# Altium schematic sheet USB2514 CRYSTAL.SchDoc
size A4; DocumentNumber: 6; SheetNumber: 6; SheetTotal: 6
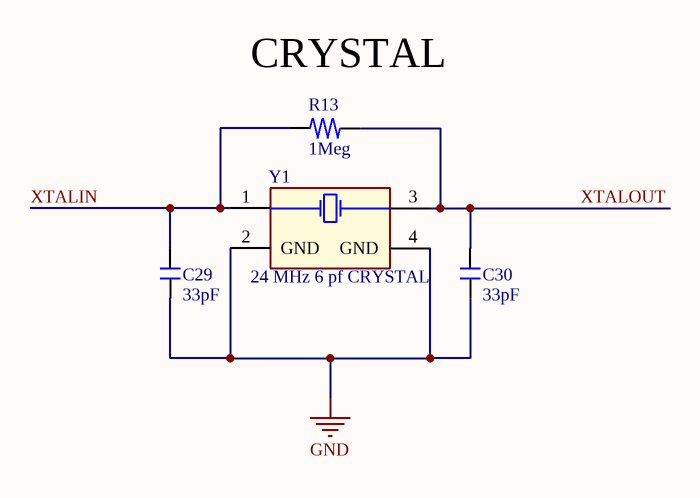
[diagram p0: USB2514 CRYSTAL.SchDoc]

## Parts
C29  33pF  [CAPC1608X06N-0603]
C30  33pF  [CAPC1608X06N-0603]
R13  1Meg  [RESC1608X06N-0603]
Y1  24 MHz 6 pf CRYSTAL  [OSC_XRCGB24M000F2P00R0]

## Nets
GND: C29.1 C30.1 Y1.2(GND) Y1.4(GND)
XTALIN: C29.2 R13.1 Y1.1
XTALOUT: C30.2 R13.2 Y1.3

## Notes on the sheet
- (near R13) CRYSTAL

## Library data of the parts
C29 C30 = CAP_0603_0.1uF
R13 = RES_0603_1K
Y1 = 24 MHz 6 pf CRYSTAL: 8 MHz 12.5 pf Osc